# Altium schematic sheet C210_0007_Sensors_220601.SchDoc: C210_0007_Sensors
size B; Date: 2/26/2021; CompanyName: U-blox; DrawnBy: EMOO; Engineer: EMOO; Organization: U-blox; Address1: 2601 25th St. SE; Address2: Salem, OR 97302; SheetNumber: 7; SheetTotal: 7; Website: www.u-blox.com; SheetSize: B; SheetTitle: C-210 Sensors
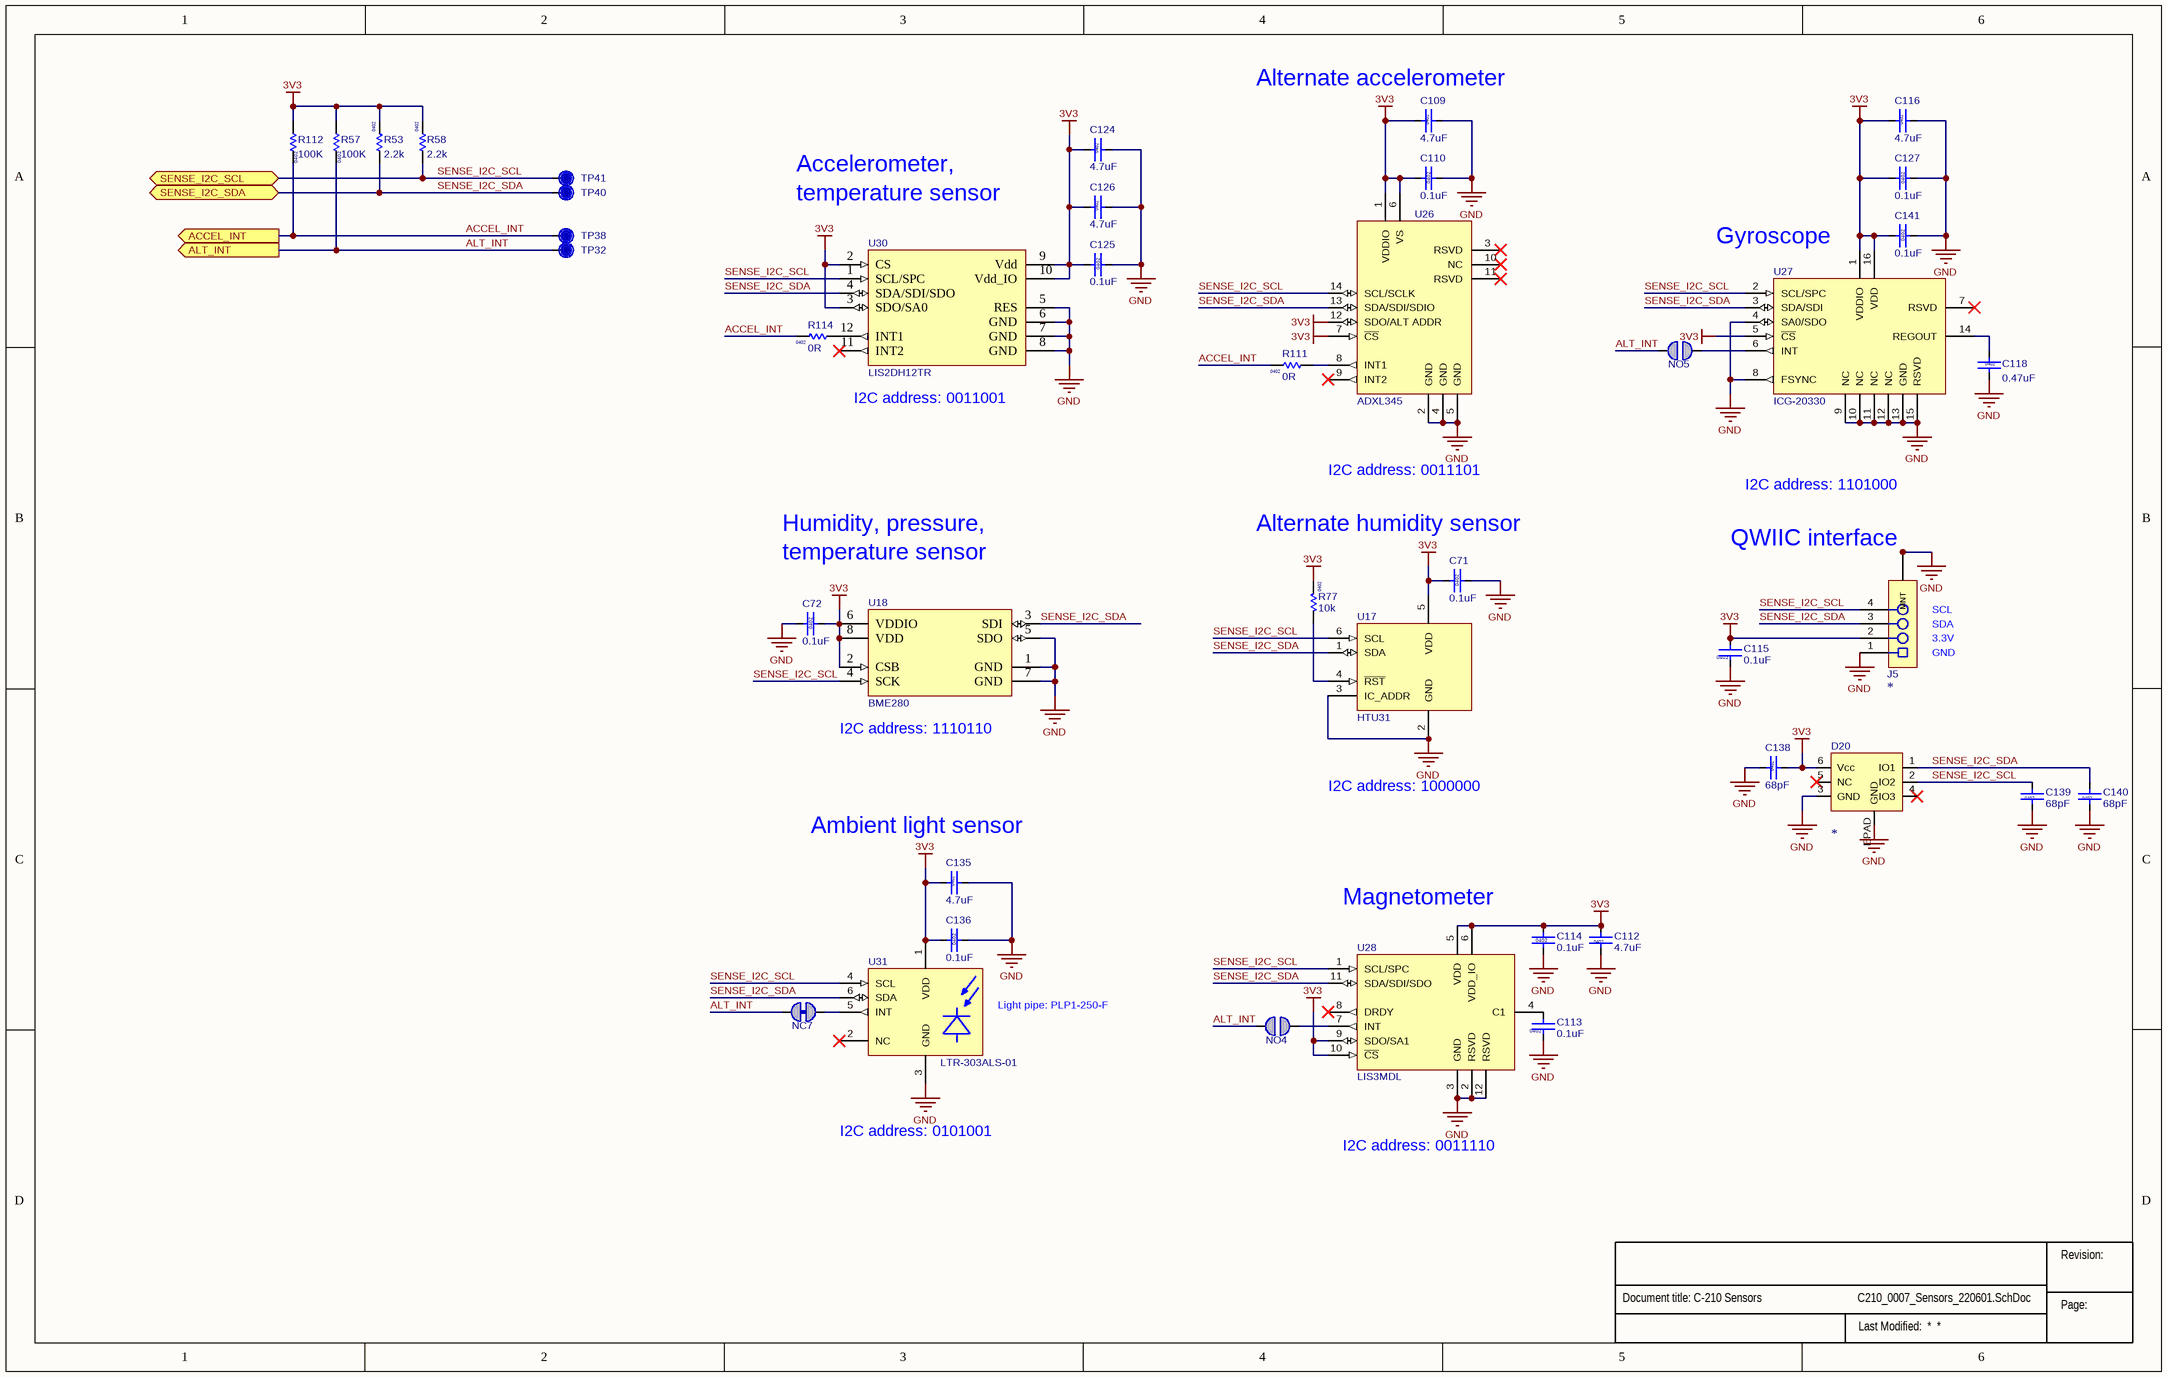
[diagram p0: C210_0007_Sensors_220601.SchDoc]

## Parts
?  (no value)  (graphical)
C71  value 0.1uF  Size: 0402  [Cap 0402 HD]  (hidden comment: 120-000160.1uF)
C72  value 0.1uF  Size: 0402  [Cap 0402 HD]  (hidden comment: 120-000160.1uF)
C109  value 4.7uF  Size: 0402  [Cap 0402 HD]
C110  value 0.1uF  Size: 0402  [Cap 0402 HD]  (hidden comment: 120-000160.1uF)
C112  value 4.7uF  Size: 0402  [Cap 0402 HD]
C113  value 0.1uF  Size: 0402  [Cap 0402 HD]  (hidden comment: 120-000160.1uF)
C114  value 0.1uF  Size: 0402  [Cap 0402 HD]  (hidden comment: 120-000160.1uF)
C115  value 0.1uF  Size: 0402  [Cap 0402 HD]  (hidden comment: 120-000160.1uF)
C116  value 4.7uF  Size: 0402  [Cap 0402 HD]
C118  value 0.47uF  Size: 0402  [Cap 0402 HD]
C124  value 4.7uF  Size: 0402  [Cap 0402 HD]
C125  value 0.1uF  Size: 0402  [Cap 0402 HD]  (hidden comment: 120-000160.1uF)
C126  value 4.7uF  Size: 0402  [Cap 0402 HD]
C127  value 0.1uF  Size: 0402  [Cap 0402 HD]  (hidden comment: 120-000160.1uF)
C135  value 4.7uF  Size: 0402  [Cap 0402 HD]
C136  value 0.1uF  Size: 0402  [Cap 0402 HD]  (hidden comment: 120-000160.1uF)
C138  value 68pF  Size: 0402  [Cap 0402 HD]
C139  value 68pF  Size: 0402  [Cap 0402 HD]
C140  value 68pF  Size: 0402  [Cap 0402 HD]
C141  value 0.1uF  Size: 0402  [Cap 0402 HD]  (hidden comment: 120-000160.1uF)
D20  (no value)  [TPD3E001DRSR]
J5  (no value)  [SM04B-SRSS-TB(LF)(SN)]
NC7  Solderbridge-ShortDNP  [Solderbridge-Short]  (value not drawn)  (net tie, no BOM)
NO4  Solderbridge-OpenDNP  [Solderbridge-Open]  (value not drawn)  (no BOM)
NO5  Solderbridge-OpenDNP  [Solderbridge-Open]  (value not drawn)  (no BOM)
R53  value 2.2k  Size: 0402  [RES 0402 HD]
R57  value 100K  Size: 0402  [RES 0402 HD]
R58  value 2.2k  Size: 0402  [RES 0402 HD]
R77  value 10k  Size: 0402  [RES 0402 HD]
R111  value 0R  Size: 0402  [RES 0402 HD]
R112  value 100K  Size: 0402  [RES 0402 HD]
R114  value 0R  Size: 0402  [RES 0402 HD]
TP32  TP  [TP12R]  (value not drawn)  (no BOM)
TP38  TP  [TP12R]  (value not drawn)  (no BOM)
TP40  TP  [TP12R]  (value not drawn)  (no BOM)
TP41  TP  [TP12R]  (value not drawn)  (no BOM)
U17  (no value)  [HTU31]
U18  (no value)  [DFN0.65P-8Pin]
U26  (no value)  [ADXL345]
U27  (no value)  [ICG-20330]
U28  (no value)  [LIS3MDL]
U30  Manufacturer P/N: LIS2DH12TR  [LGA0.5P_4x4_12Pin]
U31  (no value)  [LTR-303ALS-01]

## Ports
ACCEL_INT (out), ALT_INT (out), SENSE_I2C_SCL (bidir), SENSE_I2C_SDA (bidir)

## Nets
3V3: C71.1 C72.2 C109.1 C110.1 C112.2 C114.2 C115.2 C116.1 C124.1 C125.1 C126.1 C127.1 C135.1 C136.1 C138.2 C141.1 D20.6(Vcc) J5.2 R53.2 R57.1 R58.2 R77.2 R112.1 U17.5(VDD) U18.2(CSB) U18.6(VDDIO) U18.8(VDD) U26.1(VDDIO) U26.6(VS) U26.7(~{CS}) U26.12(SDO/ALT_ADDR) U27.1(VDDIO) U27.5(~{CS}) U27.16(VDD) U28.5(VDD) U28.6(VDD_IO) U28.9(SDO/SA1) U28.10(~{CS}) U30.2(CS) U30.3(SDO/SA0) U30.9(Vdd) U30.10(Vdd_IO) U31.1(VDD)
GND: C71.2 C72.1 C109.2 C110.2 C112.1 C113.1 C114.1 C115.1 C116.2 C118.2 C124.2 C125.2 C126.2 C127.2 C135.2 C136.2 C138.1 C139.1 C140.1 C141.2 D20.3(GND) D20.EPAD(GND) J5.1 J5.M1(MNT) J5.M2(MNT) U17.2(GND) U17.3(IC_ADDR) U18.1(GND) U18.5(SDO) U18.7(GND) U26.2(GND) U26.4(GND) U26.5(GND) U27.4(SA0/SDO) U27.8(FSYNC) U27.9(NC) U27.10(NC) U27.11(NC) U27.12(NC) U27.13(GND) U27.15(RSVD) U28.2(RSVD) U28.3(GND) U28.12(RSVD) U30.5(RES) U30.6(GND) U30.7(GND) U30.8(GND) U31.3(GND)
ACCEL_INT: R111.2 R112.2 R114.2 TP38.1 ; port ACCEL_INT
ALT_INT: NC7.2 NO4.2 NO5.2 R57.2 TP32.1 ; port ALT_INT
SENSE_I2C_SCL: C139.2 D20.2(IO2) J5.4 R58.1 TP41.1 U17.6(SCL) U18.4(SCK) U26.14(SCL/SCLK) U27.2(SCL/SPC) U28.1(SCL/SPC) U30.1(SCL/SPC) U31.4(SCL) ; port SENSE_I2C_SCL
SENSE_I2C_SDA: C140.2 D20.1(IO1) J5.3 R53.1 TP40.1 U17.1(SDA) U18.3(SDI) U26.13(SDA/SDI/SDIO) U27.3(SDA/SDI) U28.11(SDA/SDI/SDO) U30.4(SDA/SDI/SDO) U31.6(SDA) ; port SENSE_I2C_SDA
NetC113_2: C113.2 U28.4(C1)
NetC118_1: C118.1 U27.14(REGOUT)
NetNC7_1: NC7.1 U31.5(INT)
NetNO4_1: NO4.1 U28.7(INT)
NetNO5_1: NO5.1 U27.6(INT)
NetR77_1: R77.1 U17.4(~{RST})
NetR111_1: R111.1 U26.8(INT1)
NetR114_1: R114.1 U30.12(INT1)

Not connected (* = marked no-connect by the designer): D20 4(IO3)* 5(NC)*; U26 3(RSVD)* 9(INT2)* 10(NC)* 11(RSVD)*; U27 7(RSVD)*; U28 8(DRDY)*; U30 11(INT2)*; U31 2(NC)*

## Notes on the sheet
- (near C109) Alternate accelerometer
- Accelerometer,
- temperature sensor
- (near U27) Gyroscope
- I2C address: 0011001
- Humidity, pressure,
- Alternate humidity sensor
- I2C address: 0011101
- I2C address: 1101000
- (near J5) QWIIC interface
- (near J5) SCL
- (near J5) SDA
- (near J5) GND
- (near J5) 3.3V
- (near U18) I2C address: 1110110
- I2C address: 1000000
- (near C135) Ambient light sensor
- Magnetometer
- Light pipe: PLP1-250-F
- I2C address: 0101001
- I2C address: 0011110
- Revision:
- Page:

## Library data of the parts
? = Sub_Title_Block: Minimized schematic title block for all subset sheets
C71 C72 C110 C113-C115 C125 C127 C136 C141 = 120-00016: Cap, Ceramic 0.1uF 10V 10% X5R 0402; Part Name: CAP CER 0.1UF 10V 10% X5R 0402; Part_Type: Ceramic Capacitor; Manufacturer: Murata Electronics North America; Manufacturer P/N: GRM155R61A104KA01J; Item_Phase: Production; Component Mounting Type: SMT; Tolerance: +/- 10%; Use in new designs: Yes; Part Number: 120-00016; Revision: 0A; Supplier 1: Digi-Key; Supplier Part Number 1: 490-6297-1-ND; Manufacturer 2: Yageo; Manufacturer P/N 2: CC0402KRX5R6BB104; Supplier 2: Digi-Key; Supplier Part Number 2: 311-1336-1-ND; Arena Link: https://app.bom.com/a/GYHPV2L2L43KRMBK?v=spec.summary; Height: 0.55mm; Pins: 2; Temperature Coefficient: X5R; Voltage: 10V
C109 C112 C116 C124 C126 C135 = 120-00020: Cap, Ceramic 4.7uF 10V 20% X5R 0402; Manufacturer 1: Samsung Electro-Mechanics America, Inc; Manufacturer Part Number 1: CL05A475MP5NRNC; Part Name: CAP CER 4.7uF 10V 20% X5R 0402; Item Phase: In Production; Tolerance: +/- 20%; Use in new designs: Yes; UBX Code: None; Part Number: 120-00020; Supplier 1: Digi-Key; Supplier Part Number 1: 1276-1482-1-ND; Manufacturer 2: Yageo; Manufacturer Part Number 2: CC0402KRX5R6BB475; Supplier 2: Digi-Key; Supplier Part Number 2: 311-3477-1-ND; Height: 0.55mm; Max Operating Temp: 85; Min Operating Temp: -55; Pins: 2; Revision: 0C; Temperature Coefficient: X5R; Voltage: 10V
C118 = 120-00072: Cap, Ceramic, 0.47UF 10V 10% X5R 0402; Manufacturer 1: Murata Electronics North America; Manufacturer Part Number 1: GRM155R61A474KE15J; Part Name: CAP CER 0.47UF 10V 10% X5R 0402; Item Phase: In Production; Tolerance: +/- 10%; Use in new designs: Yes; UBX Code: None; Part Number: 120-00072; Supplier 1: Digi-Key; Supplier Part Number 1: 490-6305-1-ND; Manufacturer 2: Samsung Electro-Mechanics America, Inc; Manufacturer Part Number 2: CL05A474KP5NNNC; Supplier 2: Digi-Key; Supplier Part Number 2: 1276-1173-1-ND; Height: 0.55mm; Max Operating Temp: 85; Min Operating Temp: -55; Pins: 2; Revision: 0A; Temperature Coefficient: X5R; Voltage: 10V
C138-C140 = 120-00047: Cap, Ceramic, 68pF, 50V, 1%, NP0, 0402; Manufacturer 1: Murata Electronics North America; Manufacturer Part Number 1: GRM1555C1H680FA01D; Part Name: CAP CER 68PF 50V 1% NP0 0402; Item Phase: Unreleased; Tolerance: +/- 1%; Use in new designs: Yes; UBX Code: None; Part Number: 120-00047; Supplier 1: Digi-Key; Supplier Part Number 1: 490-8219-1-ND; Manufacturer 2: AVX Corporation; Manufacturer Part Number 2: 04025A680FAT2A; Supplier 2: Digi-Key; Supplier Part Number 2: 478-7881-1-ND; Height: 0.55mm; Max Operating Temp: 125; Min Operating Temp: -55; Pins: 2; Revision: None; Temperature Coefficient: NP0; Voltage: 50V
D20 = TPD3E001: TVS Diode, ESD High Speed 3-Channel Array, WSON-6, 3mmX3mm; Manufacturer 1: Texas Instruments; Part Name: Diode TVS 5V 3CH WSON-6; Current: None; Item Phase: In Production; MFG Package: WSON-6, DRS (S-PWSON-N6); Use in new designs: Yes; Voltage: 5.5V; Manufacturer Part Number 1: TPD3E001DRSR; Manufacturer 2: None; Manufacturer Part Number 2: None; Supplier 2: None; Supplier Part Number 2: None; Body Size: 3mm x 3mm; Height: 0.80mm; Max Operating Temp: 85; Min Operating Temp: -40; Pins: 6; Revision: 0A; UBX Code: None; Manufacturer P/N: *
J5 = SM04B-SRSS-TB(LF)(SN): Conn, Header, SMD, 1mm Pitch, 4 Pin, R/A, White; Manufacturer 1: JST Sales America Inc.; Part Name: CONN HEADER SMD R/A 4POS 1MM; Item Phase: In Production; Use in new designs: Yes; Voltage: None; Part Number: SM04B-SRSS-TB(LF)(SN); Manufacturer Part Number 1: SM04B-SRSS-TB(LF)(SN); Supplier 1: None; Supplier Part Number 1: None; Diameter: None; Height: 2.9mm; Max Operating Temp: None; Min Operating Temp: None; Pins: 4; Revision: 0A; UBX Code: None; Manufacturer 2: None; Manufacturer Part Number 2: None; Supplier 2: None; Supplier Part Number 2: None; Manufacturer P/N: *
NC7 = Solderbridge-Short: Added By: Paul B; Part Number: Solderbridge-Short; Height: 0; DNP: DNP; Added Date: 12/2/2015
NO4 NO5 = Solderbridge-Open: Added By: Paul B; Part Number: Solderbridge-Open; Height: 0; DNP: DNP; Added Date: 12/2/2015
R53 R58 = 180-00023: Resistor, 2.2Kohm, 1%, 1/16W, 0402; Manufacturer 1: Rohm Semiconductor; Manufacturer Part Number 1: MCR01MRTF2201; Part Name: RES SMD 2.2K OHM 1% 1/16W 0402; Item Phase: In Production; Tolerance: +/- 1%; Use in new designs: Yes; Voltage: None; Part Number: 180-00023; Supplier 1: Digi-Key; Supplier Part Number 1: RHM2.20KCDCT-ND; Manufacturer 2: Yageo; Manufacturer Part Number 2: RC0402FR-072K2L; Supplier 2: Digi-Key; Supplier Part Number 2: 311-2.20KLRCT-ND; Height: 0.4mm; Max Operating Temp: 155; Min Operating Temp: -55; Pins: 2; Power: 1/16W; Revision: 0A; UBX Code: None
R57 R112 = 180-00093: Resistor 100K ohm 1% 1/16W, 0402; Manufacturer 1: Yageo; Manufacturer Part Number 1: RC0402FR-07100KL; Part Name: RES SMD 100K ohm 1% 1/16W 0402; Item Phase: In Production; Tolerance: +/- 1%; Use in new designs: Yes; Voltage: None; Part Number: 180-00093; Supplier 1: Digi-Key; Supplier Part Number 1: 311-100KLRCT-ND; Manufacturer 2: Rohm Semiconductor; Manufacturer Part Number 2: MCR01MRTF1003; Supplier 2: Digi-Key; Supplier Part Number 2: RHM100KCDCT-ND; Height: 0.4mm; Max Operating Temp: 155; Min Operating Temp: -55; Pins: 2; Power: 1/16W; Revision: 0B; UBX Code: None
R77 = 180-00024: Resistor 10k ohm 1% 1/16W, 0402; Manufacturer 1: Samsung Electro-Mechanics America, Inc; Manufacturer Part Number 1: RC1005F103CS; Part Name: RES SMD 10K OHM 1% 1/16W 0402; Item Phase: In Production; Tolerance: +/- 1%; Use in new designs: Yes; UBX Code: None; Part Number: 180-00024; Supplier 1: Digi-Key; Supplier Part Number 1: 1276-3431-1-ND; Manufacturer 2: Hong Kong Resistors Manufactory; Manufacturer Part Number 2: RCT0210KFLF; Supplier 2: None; Supplier Part Number 2: None; Height: 0.4mm; Max Operating Temp: 155; Min Operating Temp: -55; Pins: 2; Power: 1/16W; Revision: 0E; Voltage: N/A
R111 R114 = 180-00020: Resistor 0 ohm 1/16W 0402; Manufacturer 1: Yageo; Manufacturer Part Number 1: RC0402FR-070RL; Part Name: RES SMD 0.0 OHM JUMPER 1/16W 0402; Item Phase: In Production; Tolerance: None; Use in new designs: Yes; Part Number: 180-00020; Supplier 1: Digi-Key; Supplier Part Number 1: 311-0.0LRCT-ND; Manufacturer 2: Hong Kong Resistors Manufactory; Manufacturer Part Number 2: RCT020RLF; Supplier 2: None; Supplier Part Number 2: None; Height: 0.40mm; Max Operating Temp: 155; Min Operating Temp: -55; Pins: 2; Power: 1/16W; Revision: 0E; Voltage: N/A; UBX Code: None
TP32 TP38 TP40 TP41 = TP_R: Testpoint, Round 1.0mm Dia; Part Number: TP10R; Added By: Jeremy D; Size: 1.0mm; Height: 0; DNP: DNP; Added Date: 2/1/2015; Checked By: Paul B; Checked Date: 2/5/2015
U17 = HTU31: SENSOR, Humidity, I2C, SMT, DFN-6 2.5mmX2.5mm; Manufacturer 1: TE Connectivity; Part Name: B39162B4353P810; Body Size: 1.4mm x 1.1mm; Current: None; Item Phase: In Production; MFG Package: QCS5P; Use in new designs: Yes; Part Number: HTU31; Manufacturer Part Number 1: HTU31; Height: 0.45mm; Max Operating Temp: 85; Min Operating Temp: -40; Pins: 5; Revision: 0A; Voltage: N/A; UBX Code: None
U18 = 250-00039: SENSOR PRESSURE HUMIDITY TEMP; Part_Type: Active Sensor; Manufacturer: Bosch Sensortec; Item_Phase: Pre-Production; Accuracy: ±3%; Body Size: 2.5mm x 2.5mm; Component Mounting Type: SMT; Controller Interface: I2C/SPI; MFG Package: DFN-8; Sensor Range Max: 1100 hPa; Sensor Range Min: 300 hPa; Sensor Type: Humidity/Pressure; SMT Pitch: 0.65mm; Use in new designs: Yes; Voltage: 3.6V; Manufacturer P/N: BME280; Part Number: 250-00039; Part Name: BME280; Revision: 1; Supplier 1: Digi-Key; Supplier Part Number 1: 828-1063-1-ND; Arena Link: https://app.bom.com/a/ASBJPWFWFYX2LZ4C?v=spec.summary; Height: 1mm; Package Type: DFN; Pins: 8
U26 = ADXL345: SENSOR, ACCELEROMETER, 3-AXIS, I2C, SMT, +/-16g, LGA-14 3mmX5mm; Manufacturer 1: Analog Devices; Part Name: B39162B4353P810; Body Size: 1.4mm x 1.1mm; Current: None; Item Phase: In Production; MFG Package: QCS5P; Use in new designs: Yes; Part Number: ADXL345; Manufacturer Part Number 1: ADXL345; Height: 0.45mm; Max Operating Temp: 85; Min Operating Temp: -40; Pins: 5; Revision: 0A; Voltage: N/A; UBX Code: None
U27 = ICG-20330: SENSOR, Gyroscope, I2C, 3-AXIS, 1.7-3.45V, SMT, LGA-16, 3mmX3mm; Manufacturer 1: TDK InvenSense; Part Name: LIS3MDL; Body Size: 2mm x 2mm; Current: None; Item Phase: In Production; MFG Package: LGA-12; Use in new designs: Yes; Voltage: 1.9-3.6V; Part Number: ICG-20330; Manufacturer Part Number 1: ICG-20330; Height: 1mm; Max Operating Temp: 85; Min Operating Temp: -40; Pins: 12; Revision: 0A; UBX Code: None
U28 = LIS3MDL: SENSOR, MAGNETOMETER, I2C, 3-AXIS, 1.9-3.6V, SMT, LGA-12, 2mmX2mm; Manufacturer 1: ST Micro; Current: None; Item Phase: In Production; Use in new designs: Yes; Part Number: LIS3MDL; Manufacturer Part Number 1: LIS3MDL; Body Size: 2mm x 2mm; Height: 1mm; MFG Package: LGA-12; Max Operating Temp: 85; Min Operating Temp: -40; Part Name: LIS3MDL; Pins: 12; Revision: 0A; Voltage: 1.9-3.6V; UBX Code: None
U30 = 250-00008: Accelerometer, 2G-16G Max, 12bit, LGA-12; Part_Type: Active Sensor; Manufacturer: STMicroelectronics; Item_Phase: Production; Accuracy: 1mg/digit; Bit Resolution: 12; Body Size: 2mm x 2mm; Component Mounting Type: SMT; Controller Interface: I2C/SPI; MFG Package: 12-LGA (2x2); Sensor Range Max: +/-16g; Sensor Range Min: +/-2g; SMT Pitch: 0.5mm; Use in new designs: Yes; Voltage: 3.6V; Part Number: 250-00008; Part Name: LIS2DH12; Revision: 0A; Supplier 1: Digi-Key; Supplier Part Number 1: 497-14851-1-ND; Arena Link: https://app.bom.com/a/I0JRX4N4N65KM89I?v=spec.summary; Height: 1mm; Package Type: LGA; Pins: 12; Sensor Type: Accelerometer
U31 = LTR-303ALS-01: SENSOR, AMBIENT LIGHT, I2C, SMT, GNSS, DFN-6 2mmX2mm; Manufacturer 1: Lite-On; Part Name: B39162B4353P810; Body Size: 1.4mm x 1.1mm; Current: None; Item Phase: In Production; MFG Package: QCS5P; Use in new designs: Yes; Part Number: LTR-303ALS-01; Manufacturer Part Number 1: LTR-303ALS-01; Height: 0.45mm; Max Operating Temp: 85; Min Operating Temp: -40; Pins: 5; Revision: 0A; Voltage: N/A; UBX Code: None